# Altium schematic sheet PicoZed Connector.SchDoc
size Tabloid; ApprovedBy: NA
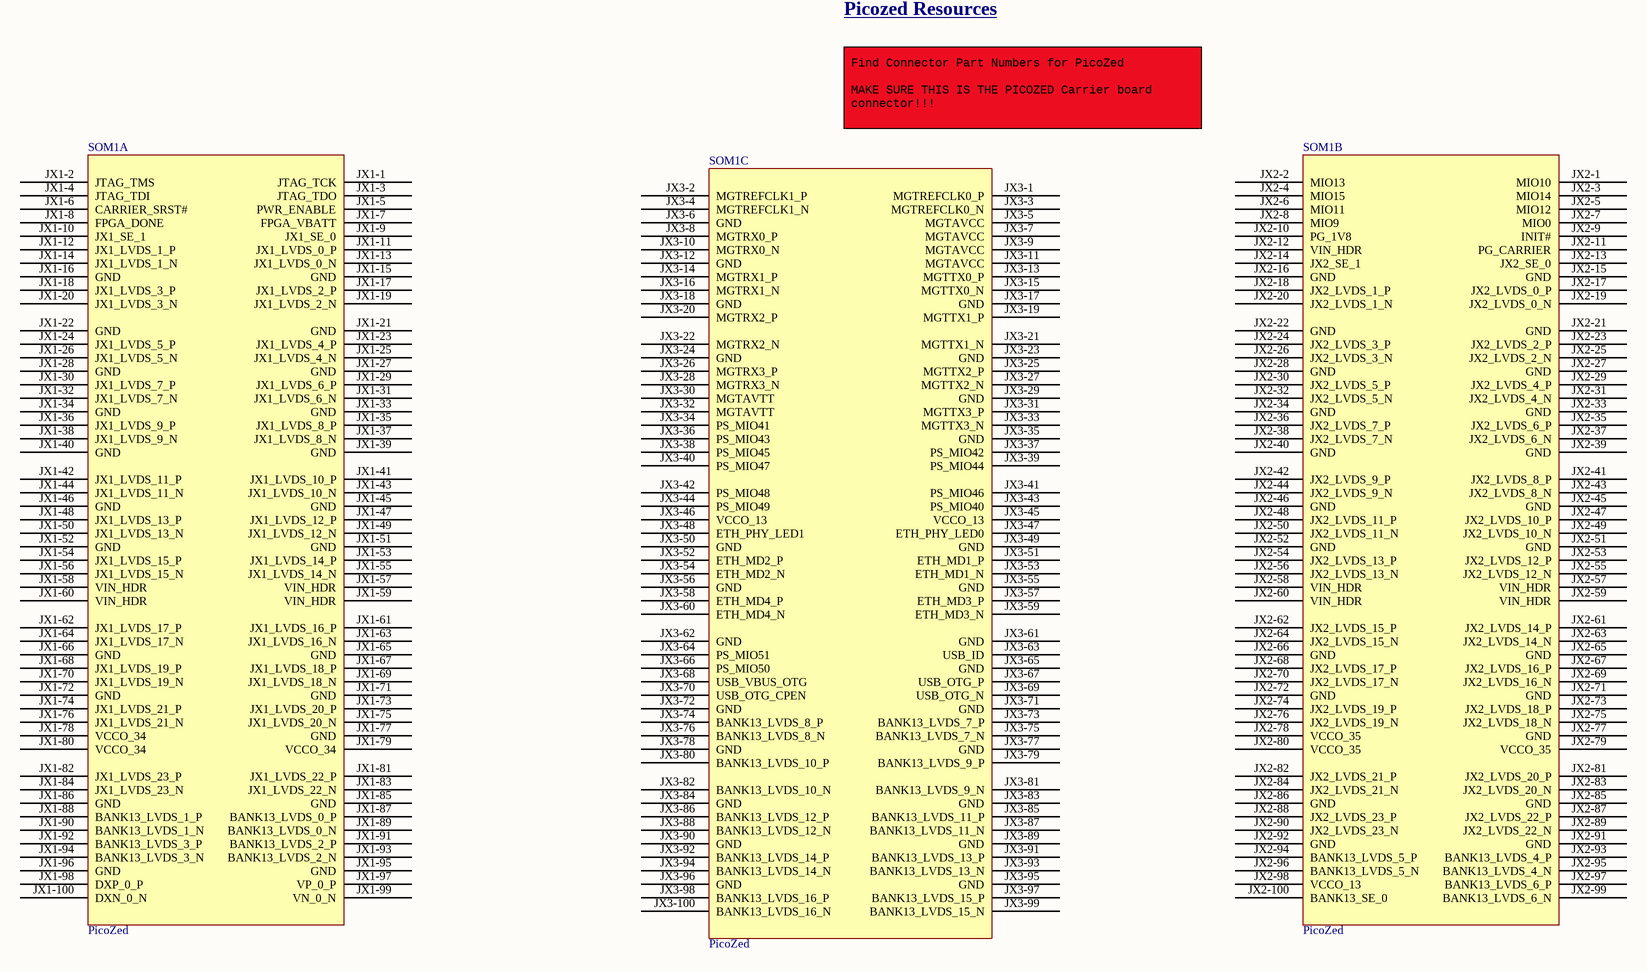
[diagram p0: PicoZed Connector.SchDoc]

## Parts
SOM1  PicoZed  [PicoZedSOM]  (parts A,B,C of 3)

## Nets

Not connected (* = marked no-connect by the designer): SOM1 JX1-1(JTAG_TCK) JX1-2(JTAG_TMS) JX1-3(JTAG_TDO) JX1-4(JTAG_TDI) JX1-5(PWR_ENABLE) JX1-6(CARRIER_SRST#) JX1-7(FPGA_VBATT) JX1-8(FPGA_DONE) JX1-9(JX1_SE_0) JX1-10(JX1_SE_1) JX1-11(JX1_LVDS_0_P) JX1-12(JX1_LVDS_1_P) JX1-13(JX1_LVDS_0_N) JX1-14(JX1_LVDS_1_N) JX1-15(GND) JX1-16(GND) JX1-17(JX1_LVDS_2_P) JX1-18(JX1_LVDS_3_P) JX1-19(JX1_LVDS_2_N) JX1-20(JX1_LVDS_3_N) JX1-21(GND) JX1-22(GND) JX1-23(JX1_LVDS_4_P) JX1-24(JX1_LVDS_5_P) JX1-25(JX1_LVDS_4_N) JX1-26(JX1_LVDS_5_N) JX1-27(GND) JX1-28(GND) JX1-29(JX1_LVDS_6_P) JX1-30(JX1_LVDS_7_P) JX1-31(JX1_LVDS_6_N) JX1-32(JX1_LVDS_7_N) JX1-33(GND) JX1-34(GND) JX1-35(JX1_LVDS_8_P) JX1-36(JX1_LVDS_9_P) JX1-37(JX1_LVDS_8_N) JX1-38(JX1_LVDS_9_N) JX1-39(GND) JX1-40(GND) JX1-41(JX1_LVDS_10_P) JX1-42(JX1_LVDS_11_P) JX1-43(JX1_LVDS_10_N) JX1-44(JX1_LVDS_11_N) JX1-45(GND) JX1-46(GND) JX1-47(JX1_LVDS_12_P) JX1-48(JX1_LVDS_13_P) JX1-49(JX1_LVDS_12_N) JX1-50(JX1_LVDS_13_N) JX1-51(GND) JX1-52(GND) JX1-53(JX1_LVDS_14_P) JX1-54(JX1_LVDS_15_P) JX1-55(JX1_LVDS_14_N) JX1-56(JX1_LVDS_15_N) JX1-57(VIN_HDR) JX1-58(VIN_HDR) JX1-59(VIN_HDR) JX1-60(VIN_HDR) JX1-61(JX1_LVDS_16_P) JX1-62(JX1_LVDS_17_P) JX1-63(JX1_LVDS_16_N) JX1-64(JX1_LVDS_17_N) JX1-65(GND) JX1-66(GND) JX1-67(JX1_LVDS_18_P) JX1-68(JX1_LVDS_19_P) JX1-69(JX1_LVDS_18_N) JX1-70(JX1_LVDS_19_N) JX1-71(GND) JX1-72(GND) JX1-73(JX1_LVDS_20_P) JX1-74(JX1_LVDS_21_P) JX1-75(JX1_LVDS_20_N) JX1-76(JX1_LVDS_21_N) JX1-77(GND) JX1-78(VCCO_34) JX1-79(VCCO_34) JX1-80(VCCO_34) JX1-81(JX1_LVDS_22_P) JX1-82(JX1_LVDS_23_P) JX1-83(JX1_LVDS_22_N) JX1-84(JX1_LVDS_23_N) JX1-85(GND) JX1-86(GND) JX1-87(BANK13_LVDS_0_P) JX1-88(BANK13_LVDS_1_P) JX1-89(BANK13_LVDS_0_N) JX1-90(BANK13_LVDS_1_N) JX1-91(BANK13_LVDS_2_P) JX1-92(BANK13_LVDS_3_P) JX1-93(BANK13_LVDS_2_N) JX1-94(BANK13_LVDS_3_N) JX1-95(GND) JX1-96(GND) JX1-97(VP_0_P) JX1-98(DXP_0_P) JX1-99(VN_0_N) JX1-100(DXN_0_N) JX2-1(MIO10) JX2-2(MIO13) JX2-3(MIO14) JX2-4(MIO15) JX2-5(MIO12) JX2-6(MIO11) JX2-7(MIO0) JX2-8(MIO9) JX2-9(INIT#) JX2-10(PG_1V8) JX2-11(PG_CARRIER) JX2-12(VIN_HDR) JX2-13(JX2_SE_0) JX2-14(JX2_SE_1) JX2-15(GND) JX2-16(GND) JX2-17(JX2_LVDS_0_P) JX2-18(JX2_LVDS_1_P) JX2-19(JX2_LVDS_0_N) JX2-20(JX2_LVDS_1_N) JX2-21(GND) JX2-22(GND) JX2-23(JX2_LVDS_2_P) JX2-24(JX2_LVDS_3_P) JX2-25(JX2_LVDS_2_N) JX2-26(JX2_LVDS_3_N) JX2-27(GND) JX2-28(GND) JX2-29(JX2_LVDS_4_P) JX2-30(JX2_LVDS_5_P) JX2-31(JX2_LVDS_4_N) JX2-32(JX2_LVDS_5_N) JX2-33(GND) JX2-34(GND) JX2-35(JX2_LVDS_6_P) JX2-36(JX2_LVDS_7_P) JX2-37(JX2_LVDS_6_N) JX2-38(JX2_LVDS_7_N) JX2-39(GND) JX2-40(GND) JX2-41(JX2_LVDS_8_P) JX2-42(JX2_LVDS_9_P) JX2-43(JX2_LVDS_8_N) JX2-44(JX2_LVDS_9_N) JX2-45(GND) JX2-46(GND) JX2-47(JX2_LVDS_10_P) JX2-48(JX2_LVDS_11_P) JX2-49(JX2_LVDS_10_N) JX2-50(JX2_LVDS_11_N) JX2-51(GND) JX2-52(GND) JX2-53(JX2_LVDS_12_P) JX2-54(JX2_LVDS_13_P) JX2-55(JX2_LVDS_12_N) JX2-56(JX2_LVDS_13_N) JX2-57(VIN_HDR) JX2-58(VIN_HDR) JX2-59(VIN_HDR) JX2-60(VIN_HDR) JX2-61(JX2_LVDS_14_P) JX2-62(JX2_LVDS_15_P) JX2-63(JX2_LVDS_14_N) JX2-64(JX2_LVDS_15_N) JX2-65(GND) JX2-66(GND) JX2-67(JX2_LVDS_16_P) JX2-68(JX2_LVDS_17_P) JX2-69(JX2_LVDS_16_N) JX2-70(JX2_LVDS_17_N) JX2-71(GND) JX2-72(GND) JX2-73(JX2_LVDS_18_P) JX2-74(JX2_LVDS_19_P) JX2-75(JX2_LVDS_18_N) JX2-76(JX2_LVDS_19_N) JX2-77(GND) JX2-78(VCCO_35) JX2-79(VCCO_35) JX2-80(VCCO_35) JX2-81(JX2_LVDS_20_P) JX2-82(JX2_LVDS_21_P) JX2-83(JX2_LVDS_20_N) JX2-84(JX2_LVDS_21_N) JX2-85(GND) JX2-86(GND) JX2-87(JX2_LVDS_22_P) JX2-88(JX2_LVDS_23_P) JX2-89(JX2_LVDS_22_N) JX2-90(JX2_LVDS_23_N) JX2-91(GND) JX2-92(GND) JX2-93(BANK13_LVDS_4_P) JX2-94(BANK13_LVDS_5_P) JX2-95(BANK13_LVDS_4_N) JX2-96(BANK13_LVDS_5_N) JX2-97(BANK13_LVDS_6_P) JX2-98(VCCO_13) JX2-99(BANK13_LVDS_6_N) JX2-100(BANK13_SE_0) JX3-1(MGTREFCLK0_P) JX3-2(MGTREFCLK1_P) JX3-3(MGTREFCLK0_N) JX3-4(MGTREFCLK1_N) JX3-5(MGTAVCC) JX3-6(GND) JX3-7(MGTAVCC) JX3-8(MGTRX0_P) JX3-9(MGTAVCC) JX3-10(MGTRX0_N) JX3-11(MGTAVCC) JX3-12(GND) JX3-13(MGTTX0_P) JX3-14(MGTRX1_P) JX3-15(MGTTX0_N) JX3-16(MGTRX1_N) JX3-17(GND) JX3-18(GND) JX3-19(MGTTX1_P) JX3-20(MGTRX2_P) JX3-21(MGTTX1_N) JX3-22(MGTRX2_N) JX3-23(GND) JX3-24(GND) JX3-25(MGTTX2_P) JX3-26(MGTRX3_P) JX3-27(MGTTX2_N) JX3-28(MGTRX3_N) JX3-29(GND) JX3-30(MGTAVTT) JX3-31(MGTTX3_P) JX3-32(MGTAVTT) JX3-33(MGTTX3_N) JX3-34(PS_MIO41) JX3-35(GND) JX3-36(PS_MIO43) JX3-37(PS_MIO42) JX3-38(PS_MIO45) JX3-39(PS_MIO44) JX3-40(PS_MIO47) JX3-41(PS_MIO46) JX3-42(PS_MIO48) JX3-43(PS_MIO40) JX3-44(PS_MIO49) JX3-45(VCCO_13) JX3-46(VCCO_13) JX3-47(ETH_PHY_LED0) JX3-48(ETH_PHY_LED1) JX3-49(GND) JX3-50(GND) JX3-51(ETH_MD1_P) JX3-52(ETH_MD2_P) JX3-53(ETH_MD1_N) JX3-54(ETH_MD2_N) JX3-55(GND) JX3-56(GND) JX3-57(ETH_MD3_P) JX3-58(ETH_MD4_P) JX3-59(ETH_MD3_N) JX3-60(ETH_MD4_N) JX3-61(GND) JX3-62(GND) JX3-63(USB_ID) JX3-64(PS_MIO51) JX3-65(GND) JX3-66(PS_MIO50) JX3-67(USB_OTG_P) JX3-68(USB_VBUS_OTG) JX3-69(USB_OTG_N) JX3-70(USB_OTG_CPEN) JX3-71(GND) JX3-72(GND) JX3-73(BANK13_LVDS_7_P) JX3-74(BANK13_LVDS_8_P) JX3-75(BANK13_LVDS_7_N) JX3-76(BANK13_LVDS_8_N) JX3-77(GND) JX3-78(GND) JX3-79(BANK13_LVDS_9_P) JX3-80(BANK13_LVDS_10_P) JX3-81(BANK13_LVDS_9_N) JX3-82(BANK13_LVDS_10_N) JX3-83(GND) JX3-84(GND) JX3-85(BANK13_LVDS_11_P) JX3-86(BANK13_LVDS_12_P) JX3-87(BANK13_LVDS_11_N) JX3-88(BANK13_LVDS_12_N) JX3-89(GND) JX3-90(GND) JX3-91(BANK13_LVDS_13_P) JX3-92(BANK13_LVDS_14_P) JX3-93(BANK13_LVDS_13_N) JX3-94(BANK13_LVDS_14_N) JX3-95(GND) JX3-96(GND) JX3-97(BANK13_LVDS_15_P) JX3-98(BANK13_LVDS_16_P) JX3-99(BANK13_LVDS_15_N) JX3-100(BANK13_LVDS_16_N)

## Notes on the sheet
- Picozed Resources <http://zedboard.org/support/documentation/4736>
- Find Connector Part Numbers for PicoZed
  MAKE SURE THIS IS THE PICOZED Carrier board connector!!!
  AAAHHH THIS IS!!!
- Project:
- http://www.cospandesign.com
- Cospan Design
- Document:
- Engineer:
- Title:
- Client:
- Approved By:
- Revision:
- Date:
- Number:
- of

## Library data of the parts
SOM1 = PicoZed_SOM: PicoZed SOM Carrier Footprint